# Altium schematic sheet RAM.SchDoc
size B; Organization: Pyrotechnics Management Inc.; DocumentNumber: 10; SheetNumber: 10; SheetTotal: 14; PageSetup: Record=PageOptions|CenterHorizontal=True|CenterVertical=True|PrintScale=0.99|XCorrection=1.00|YCorrection=1.00|PrintKind=1|BorderSize=5000000|LeftOffset=0|BottomOffset=0|Orientation=2|PaperLength=1000|PaperWidth=1000|Scale=100|PaperSource=7|PrintQuality=-4|MediaType=1|DitherType=10|PaperKind=Tabloid (11 x 17")|PrintScaleMode=1; SCHEMATIC_SHEET_TITLE: RAM; PAGE_TITLE: -
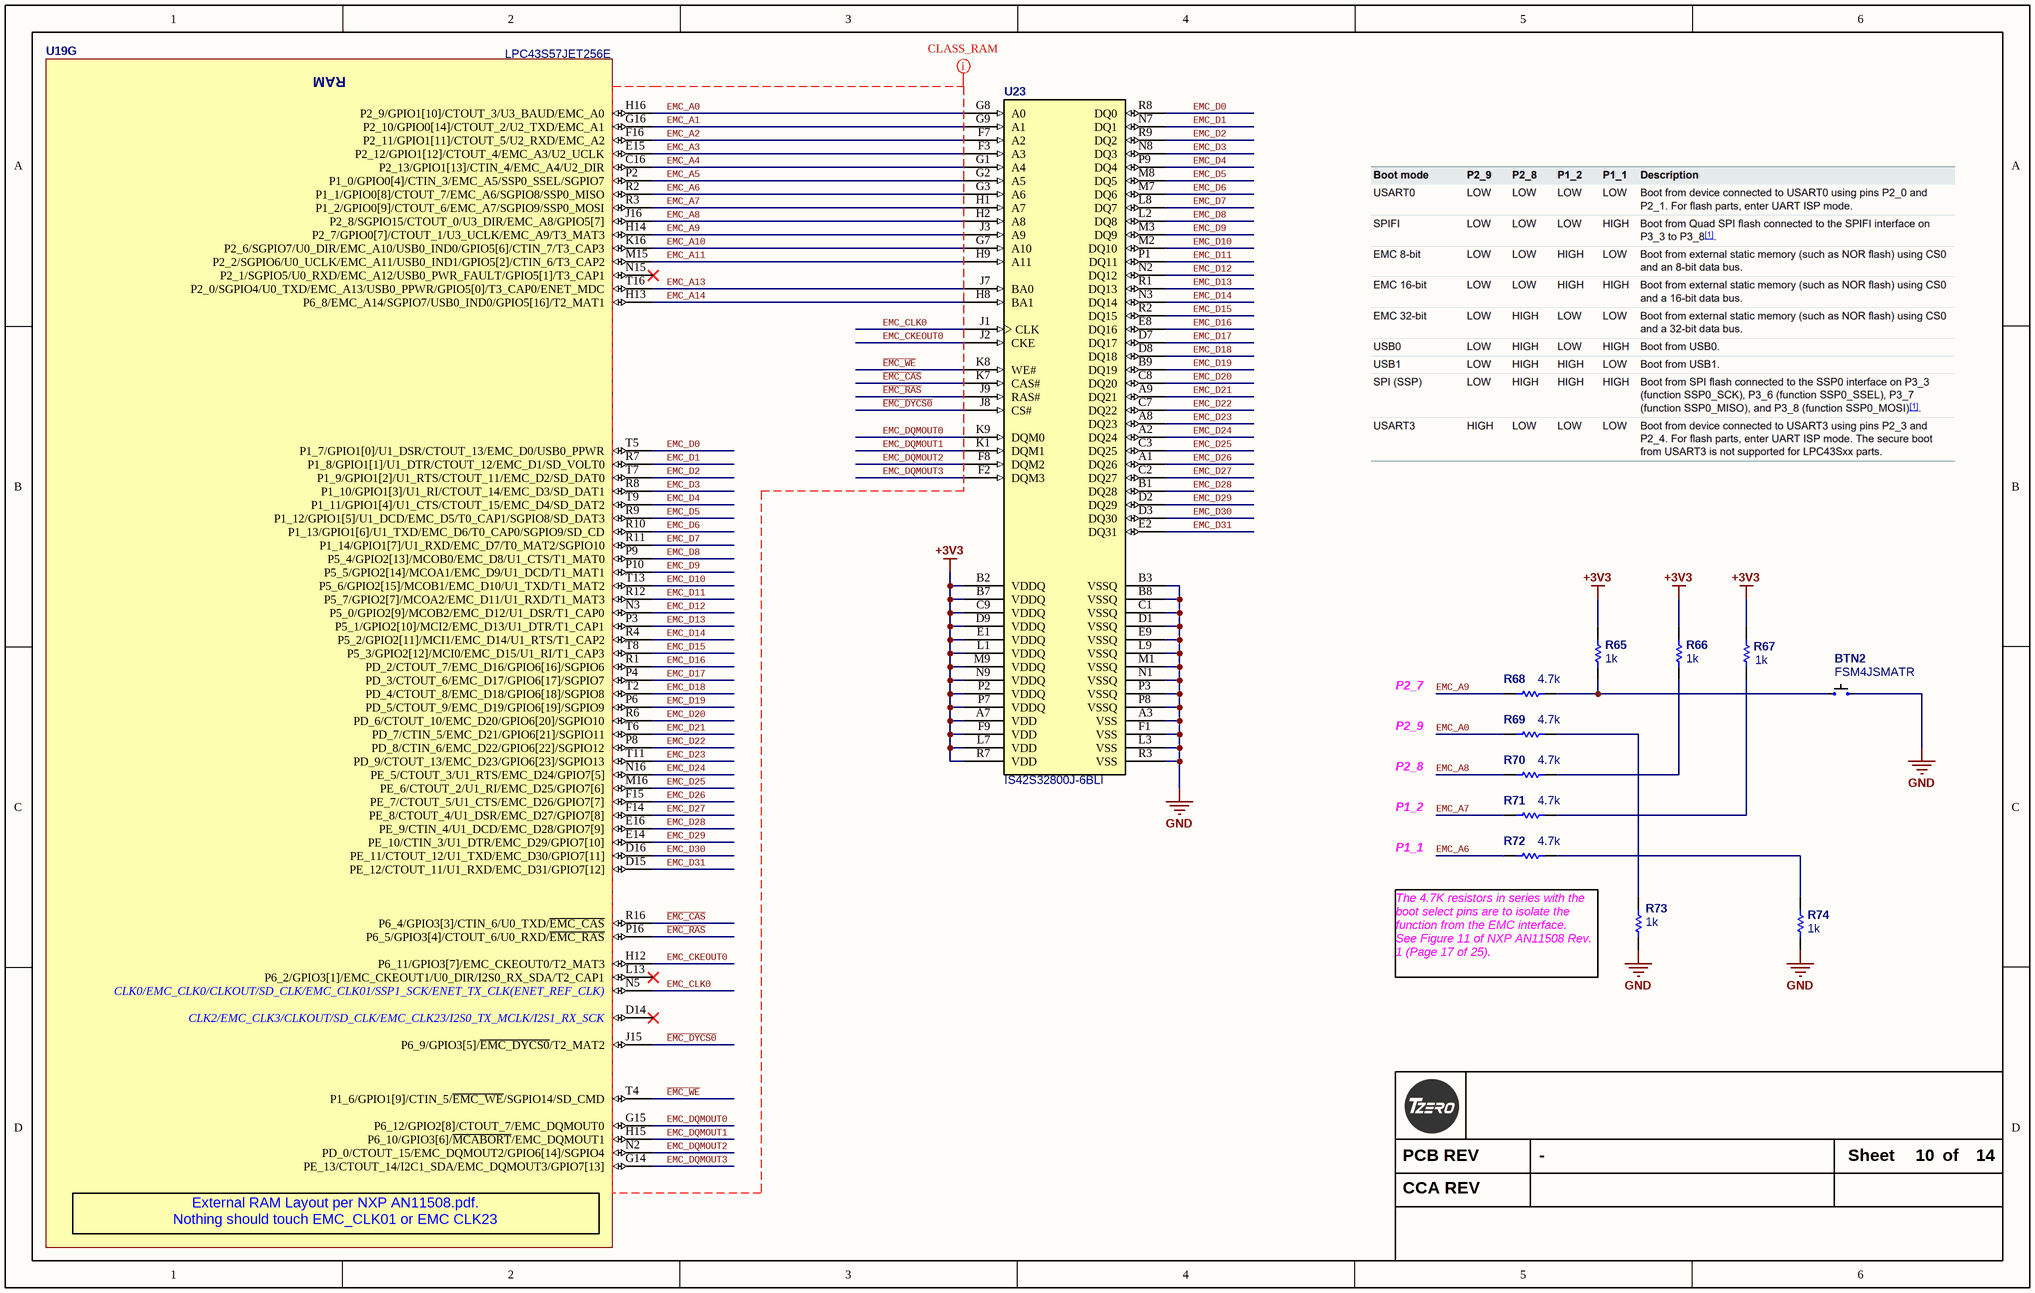
[diagram p0: RAM.SchDoc]

## Parts
BTN2  FSM4JSMATR  [FSM4JSMA]
R65  1k  [R0603_0.55MM_MD]
R66  1k  [R0603_0.55MM_MD]
R67  1k  [R0603_0.55MM_MD]
R68  4.7k  [R0603_0.55MM_MD]
R69  4.7k  [R0603_0.55MM_MD]
R70  4.7k  [R0603_0.55MM_MD]
R71  4.7k  [R0603_0.55MM_MD]
R72  4.7k  [R0603_0.55MM_MD]
R73  1k  [R0603_0.55MM_MD]
R74  1k  [R0603_0.55MM_MD]
U19  LPC43S57JET256E  [LBGA256 16X16 1700X1700X155]  (part G of 10)
U23  IS42S32800J-6BLI  [TFBGA90_8x13]

## Nets
+3V3: R65.2 R66.2 R67.2 U23.A7(VDD) U23.B2(VDDQ) U23.B7(VDDQ) U23.C9(VDDQ) U23.D9(VDDQ) U23.E1(VDDQ) U23.F9(VDD) U23.L1(VDDQ) U23.L7(VDD) U23.M9(VDDQ) U23.N9(VDDQ) U23.P2(VDDQ) U23.P7(VDDQ) U23.R7(VDD)
GND: BTN2.B R73.1 R74.1 U23.A3(VSS) U23.B3(VSSQ) U23.B8(VSSQ) U23.C1(VSSQ) U23.D1(VSSQ) U23.E9(VSSQ) U23.F1(VSS) U23.L3(VSS) U23.L9(VSSQ) U23.M1(VSSQ) U23.N1(VSSQ) U23.P3(VSSQ) U23.P8(VSSQ) U23.R3(VSS)
~{EMC_CAS}: U19.R16(P6_4/GPIO3[3]/CTIN_6/U0_TXD/~{EMC_CAS}) U23.K7(CAS#)
~{EMC_DYCS0}: U19.J15(P6_9/GPIO3[5]/~{EMC_DYCS0}/T2_MAT2) U23.J8(CS#)
~{EMC_RAS}: U19.P16(P6_5/GPIO3[4]/CTOUT_6/U0_RXD/~{EMC_RAS}) U23.J9(RAS#)
~{EMC_WE}: U19.T4(P1_6/GPIO1[9]/CTIN_5/~{EMC_WE}/SGPIO14/SD_CMD) U23.K8(WE#)
EMC_A0: R69.2 U19.H16(P2_9/GPIO1[10]/CTOUT_3/U3_BAUD/EMC_A0) U23.G8(A0)
EMC_A1: U19.G16(P2_10/GPIO0[14]/CTOUT_2/U2_TXD/EMC_A1) U23.G9(A1)
EMC_A2: U19.F16(P2_11/GPIO1[11]/CTOUT_5/U2_RXD/EMC_A2) U23.F7(A2)
EMC_A3: U19.E15(P2_12/GPIO1[12]/CTOUT_4/EMC_A3/U2_UCLK) U23.F3(A3)
EMC_A4: U19.C16(P2_13/GPIO1[13]/CTIN_4/EMC_A4/U2_DIR) U23.G1(A4)
EMC_A5: U19.P2(P1_0/GPIO0[4]/CTIN_3/EMC_A5/SSP0_SSEL/SGPIO7) U23.G2(A5)
EMC_A6: R72.2 U19.R2(P1_1/GPIO0[8]/CTOUT_7/EMC_A6/SGPIO8/SSP0_MISO) U23.G3(A6)
EMC_A7: R71.2 U19.R3(P1_2/GPIO0[9]/CTOUT_6/EMC_A7/SGPIO9/SSP0_MOSI) U23.H1(A7)
EMC_A8: R70.2 U19.J16(P2_8/SGPIO15/CTOUT_0/U3_DIR/EMC_A8/GPIO5[7]) U23.H2(A8)
EMC_A9: R68.2 U19.H14(P2_7/GPIO0[7]/CTOUT_1/U3_UCLK/EMC_A9/T3_MAT3) U23.J3(A9)
EMC_A10: U19.K16(P2_6/SGPIO7/U0_DIR/EMC_A10/USB0_IND0/GPIO5[6]/CTIN_7/T3_CAP3) U23.G7(A10)
EMC_A11: U19.M15(P2_2/SGPIO6/U0_UCLK/EMC_A11/USB0_IND1/GPIO5[2]/CTIN_6/T3_CAP2) U23.H9(A11)
EMC_A13: U19.T16(P2_0/SGPIO4/U0_TXD/EMC_A13/USB0_PPWR/GPIO5[0]/T3_CAP0/ENET_MDC) U23.J7(BA0)
EMC_A14: U19.H13(P6_8/EMC_A14/SGPIO7/USB0_IND0/GPIO5[16]/T2_MAT1) U23.H8(BA1)
EMC_CKEOUT0: U19.H12(P6_11/GPIO3[7]/EMC_CKEOUT0/T2_MAT3) U23.J2(CKE)
EMC_CLK0: U19.N5(CLK0/EMC_CLK0/CLKOUT/SD_CLK/EMC_CLK01/SSP1_SCK/ENET_TX_CLK(ENET_REF_CLK)) U23.J1(CLK)
EMC_D0: U19.T5(P1_7/GPIO1[0]/U1_DSR/CTOUT_13/EMC_D0/USB0_PPWR) U23.R8(DQ0)
EMC_D1: U19.R7(P1_8/GPIO1[1]/U1_DTR/CTOUT_12/EMC_D1/SD_VOLT0) U23.N7(DQ1)
EMC_D2: U19.T7(P1_9/GPIO1[2]/U1_RTS/CTOUT_11/EMC_D2/SD_DAT0) U23.R9(DQ2)
EMC_D3: U19.R8(P1_10/GPIO1[3]/U1_RI/CTOUT_14/EMC_D3/SD_DAT1) U23.N8(DQ3)
EMC_D4: U19.T9(P1_11/GPIO1[4]/U1_CTS/CTOUT_15/EMC_D4/SD_DAT2) U23.P9(DQ4)
EMC_D5: U19.R9(P1_12/GPIO1[5]/U1_DCD/EMC_D5/T0_CAP1/SGPIO8/SD_DAT3) U23.M8(DQ5)
EMC_D6: U19.R10(P1_13/GPIO1[6]/U1_TXD/EMC_D6/T0_CAP0/SGPIO9/SD_CD) U23.M7(DQ6)
EMC_D7: U19.R11(P1_14/GPIO1[7]/U1_RXD/EMC_D7/T0_MAT2/SGPIO10) U23.L8(DQ7)
EMC_D8: U19.P9(P5_4/GPIO2[13]/MCOB0/EMC_D8/U1_CTS/T1_MAT0) U23.L2(DQ8)
EMC_D9: U19.P10(P5_5/GPIO2[14]/MCOA1/EMC_D9/U1_DCD/T1_MAT1) U23.M3(DQ9)
EMC_D10: U19.T13(P5_6/GPIO2[15]/MCOB1/EMC_D10/U1_TXD/T1_MAT2) U23.M2(DQ10)
EMC_D11: U19.R12(P5_7/GPIO2[7]/MCOA2/EMC_D11/U1_RXD/T1_MAT3) U23.P1(DQ11)
EMC_D12: U19.N3(P5_0/GPIO2[9]/MCOB2/EMC_D12/U1_DSR/T1_CAP0) U23.N2(DQ12)
EMC_D13: U19.P3(P5_1/GPIO2[10]/MCI2/EMC_D13/U1_DTR/T1_CAP1) U23.R1(DQ13)
EMC_D14: U19.R4(P5_2/GPIO2[11]/MCI1/EMC_D14/U1_RTS/T1_CAP2) U23.N3(DQ14)
EMC_D15: U19.T8(P5_3/GPIO2[12]/MCI0/EMC_D15/U1_RI/T1_CAP3) U23.R2(DQ15)
EMC_D16: U19.R1(PD_2/CTOUT_7/EMC_D16/GPIO6[16]/SGPIO6) U23.E8(DQ16)
EMC_D17: U19.P4(PD_3/CTOUT_6/EMC_D17/GPIO6[17]/SGPIO7) U23.D7(DQ17)
EMC_D18: U19.T2(PD_4/CTOUT_8/EMC_D18/GPIO6[18]/SGPIO8) U23.D8(DQ18)
EMC_D19: U19.P6(PD_5/CTOUT_9/EMC_D19/GPIO6[19]/SGPIO9) U23.B9(DQ19)
EMC_D20: U19.R6(PD_6/CTOUT_10/EMC_D20/GPIO6[20]/SGPIO10) U23.C8(DQ20)
EMC_D21: U19.T6(PD_7/CTIN_5/EMC_D21/GPIO6[21]/SGPIO11) U23.A9(DQ21)
EMC_D22: U19.P8(PD_8/CTIN_6/EMC_D22/GPIO6[22]/SGPIO12) U23.C7(DQ22)
EMC_D23: U19.T11(PD_9/CTOUT_13/EMC_D23/GPIO6[23]/SGPIO13) U23.A8(DQ23)
EMC_D24: U19.N16(PE_5/CTOUT_3/U1_RTS/EMC_D24/GPIO7[5]) U23.A2(DQ24)
EMC_D25: U19.M16(PE_6/CTOUT_2/U1_RI/EMC_D25/GPIO7[6]) U23.C3(DQ25)
EMC_D26: U19.F15(PE_7/CTOUT_5/U1_CTS/EMC_D26/GPIO7[7]) U23.A1(DQ26)
EMC_D27: U19.F14(PE_8/CTOUT_4/U1_DSR/EMC_D27/GPIO7[8]) U23.C2(DQ27)
EMC_D28: U19.E16(PE_9/CTIN_4/U1_DCD/EMC_D28/GPIO7[9]) U23.B1(DQ28)
EMC_D29: U19.E14(PE_10/CTIN_3/U1_DTR/EMC_D29/GPIO7[10]) U23.D2(DQ29)
EMC_D30: U19.D16(PE_11/CTOUT_12/U1_TXD/EMC_D30/GPIO7[11]) U23.D3(DQ30)
EMC_D31: U19.D15(PE_12/CTOUT_11/U1_RXD/EMC_D31/GPIO7[12]) U23.E2(DQ31)
EMC_DQMOUT0: U19.G15(P6_12/GPIO2[8]/CTOUT_7/EMC_DQMOUT0) U23.K9(DQM0)
EMC_DQMOUT1: U19.H15(P6_10/GPIO3[6]/~{MCABORT}/EMC_DQMOUT1) U23.K1(DQM1)
EMC_DQMOUT2: U19.N2(PD_0/CTOUT_15/EMC_DQMOUT2/GPIO6[14]/SGPIO4) U23.F8(DQM2)
EMC_DQMOUT3: U19.G14(PE_13/CTOUT_14/I2C1_SDA/EMC_DQMOUT3/GPIO7[13]) U23.F2(DQM3)
NetBTN2_A: BTN2.A R65.1 R68.1
NetR66_1: R66.1 R70.1
NetR67_1: R67.1 R71.1
NetR69_1: R69.1 R73.2
NetR72_1: R72.1 R74.2

Not connected (* = marked no-connect by the designer): U19 D14(CLK2/EMC_CLK3/CLKOUT/SD_CLK/EMC_CLK23/I2S0_TX_MCLK/I2S1_RX_SCK)* L13(P6_2/GPIO3[1]/EMC_CKEOUT1/U0_DIR/I2S0_RX_SDA/T2_CAP1)* N15(P2_1/SGPIO5/U0_RXD/EMC_A12/USB0_PWR_FAULT/GPIO5[1]/T3_CAP1)*

## Layout directives
net class CLASS_RAM: EMC_A0, EMC_A1, EMC_A2, EMC_A3, EMC_A4, EMC_A5, EMC_A6, EMC_A7, EMC_A8, EMC_A9, EMC_A10, EMC_A11, EMC_A13, EMC_A14, EMC_CKEOUT0, EMC_CLK0, EMC_D0, EMC_D1, EMC_D2, EMC_D3, EMC_D4, EMC_D5, EMC_D6, EMC_D7, EMC_D8, EMC_D9, EMC_D10, EMC_D11, EMC_D12, EMC_D13, EMC_D14, EMC_D15, EMC_D16, EMC_D17, EMC_D18, EMC_D19, EMC_D20, EMC_D21, EMC_D22, EMC_D23, EMC_D24, EMC_D25, EMC_D26, EMC_D27, EMC_D28, EMC_D29, EMC_D30, EMC_D31, EMC_DQMOUT0, EMC_DQMOUT1, EMC_DQMOUT2, EMC_DQMOUT3, ~{EMC_CAS}, ~{EMC_DYCS0}, ~{EMC_RAS}, ~{EMC_WE}

## Notes on the sheet
- P2_7
- P2_9
- P2_8
- P1_2
- P1_1
- The 4.7K resistors in series with the boot select pins are to isolate the function from the EMC interface.   See Figure 11 of NXP AN11508 Rev. 1 (Page 17 of 25).
- PCB REV
- Sheet
- of
- CCA REV
- (in symbol LPC43S57JET256E, part G) RAM; External RAM Layout per NXP AN11508.pdf. / Nothing should touch EMC_CLK01 or EMC CLK23

## Library data of the parts
BTN2 = FSM4JSMATR: SWITCH TACTILE SPST-NO 0.05A 12V; Manufacturer: TE Connectivity; Switch Function: Off-Mom; Contact Rating @ Voltage: 0.05A @ 12VDC; Actuator Type: Standard; Actuator Orientation: Top Actuated; Outline: 6.00mm x 6.00mm; Illumination: Non-Illuminated; Operating Force: 160gf; Supplier 1: Digi-Key; Supplier Part Number 1: 450-1759-1-ND; Manufacturer Part Number: FSM4JSMATR; RoHS: RoHS Compliant; Category: Switches; Stock 1: 35617; Pricing 1: 1=0.36, 10=0.34, 25=0.2912, 50=0.2474, 100=0.2377, 250=0.21344, 500=0.20374 (USD); Circuit: SPST-NO; Mounting Type: Surface Mount; Termination Style: Gull Wing; Packaging: Cut Tape (CT); ComponentLink1URL: http://documents.tycoelectronics.com/commerce/DocumentDelivery/DDEController?Action=srchrtrv&DocNm=2-1437565-7&DocType=CD&DocLang=EN; ComponentLink1Description: http://documents.tycoelectronics.com/commerce/DocumentDelivery/DDEController?Action=srchrtrv&DocNm=2-1437565-7&DocType=CD&DocLang=EN; Value: FSM4JSMATR
R65-R67 R73 R74 = ERJ-3EKF1001V: RES 1K OHM 1/10W 1% 0603 SMD; Manufacturer: Panasonic Electronic Components; Power (Watts): 0.1W- 1/10W; Temperature Coefficient: ±100ppm/°C; Package Power: 0603  (0.1W); Limiting Element Voltage: 75; Maximum Overload Voltage: 150; Maximum Working Voltage: 10.0V; Substitution Notes: 1k , ±1% , 0603 , AEC-Q200; Value: 1k; Supplier 1: Digi-Key; Supplier Part Number 1: P1.00KHCT-ND; Manufacturer Part Number: ERJ-3EKF1001V; Category: Resistors; Sort Value: 1000; Composition: Thick Film; Features: -; Tolerance: ±1%; Package: 0603 (1608 Metric); Size / Dimension: 0.063" L x 0.031" W (1.60mm x 0.80mm); Height: 0.55MM; Packaging: Cut Tape (CT); ComponentLink1URL: datasheets\Panasonic Electronic Components\AOA0000CE2.pdf; ComponentLink1Description: Internal Datasheet; ComponentLink2Description: External Datasheet; ComponentLink2URL: http://industrial.panasonic.com/www-data/pdf/AOA0000/AOA0000CE2.pdf; Resistance (Ohms): 1k; Supplier Package: 0603; Number of Terminations: 2; Sort Value Package: 603_1000; Ratings: AEC-Q200
R68-R72 = ERJ-3EKF4701V: RES 4.7K OHM 1/10W 1% 0603 SMD; Manufacturer: Panasonic Electronic Components; Power (Watts): 0.1W- 1/10W; Temperature Coefficient: ±100ppm/°C; Package Power: 0603  (0.1W); Limiting Element Voltage: 75; Maximum Overload Voltage: 150; Maximum Working Voltage: 21.7V; Substitution Notes: 4.7k , ±1% , 0603 , AEC-Q200; Value: 4.7k; Supplier 1: Digi-Key; Supplier Part Number 1: P4.70KHCT-ND; Manufacturer Part Number: ERJ-3EKF4701V; Category: Resistors; Sort Value: 4700; Composition: Thick Film; Features: -; Tolerance: ±1%; Package: 0603 (1608 Metric); Size / Dimension: 0.063" L x 0.031" W (1.60mm x 0.80mm); Height: 0.55MM; Packaging: Cut Tape (CT); ComponentLink1URL: datasheets\Panasonic Electronic Components\AOA0000CE2.pdf; ComponentLink1Description: Internal Datasheet; ComponentLink2Description: External Datasheet; ComponentLink2URL: http://industrial.panasonic.com/www-data/pdf/AOA0000/AOA0000CE2.pdf; Resistance (Ohms): 4.7k; Supplier Package: 0603; Number of Terminations: 2; Sort Value Package: 603_4700; Ratings: AEC-Q200
U19 = LPC43S57JET256E: ARM Microcontrollers - MCU CortexM0/4 32bit 1MB Cortex-M4/M0; Manufacturer: NXP Semiconductors; CategorySort: 600; Data RAM Size: 136 KB; Core: ARM Cortex M4/M0; Maximum Clock Frequency: 204 MHz; On-Chip ADC: Yes; Operating Supply Voltage: 2.2 V to 3.6 V; Processor Series: LPC4357; Product Status: New Technology; Value: LPC43S57JET256E; Sort Value: *; Category: Integrated Circuits; Supplier 1: Digi-Key; Supplier Part Number 1: 568-11712-ND; Manufacturer Part Number: LPC43S57JET256E; RoHS: RoHS Compliant; Stock 1: 108; Pricing 1: 1=14.40, 25=13.31, 100=12.24, 250=11.16, 500=10.43, 1000=9.57 (USD); Package: LBGA-256; Packaging: Tray; Mounting Style: SMD/SMT; Program Memory Size: 1 MB; Data Bus Width: 32 bit; Maximum Operating Temperature: + 85 C; Minimum Operating Temperature: - 40 C; Standard Pack Qty: 90; Tradename: LPC; RoHS - Mouser: Y; Minimum Order Quantity: 1; Reeling: False; ComponentLink1URL: http://www.nxp.com/documents/data_sheet/LPC4357_53_37_33.pdf; ComponentLink1Description: http://www.nxp.com/documents/data_sheet/LPC4357_53_37_33.pdf
U23 = IS42S32800J-6BLI: IC DRAM 256M PARALLEL 90TFBGA; Manufacturer: ISSI; CategorySort: 600; Packaging 1: Tray; Memory Type: RAM,SDRAM; Frequency: 166MHz; Category: Integrated Circuits; Value: IS42S32800J-6BLI; Supplier 1: Digi-Key; Supplier Part Number 1: 706-1451-ND; Manufacturer Part Number: IS42S32800J-6BLI; Stock 1: 49; Pricing 1: 1=8.98000, 10=8.26100, 25=8.08960, 50=8.06100, 100=7.23150, 250=7.01224, 500=6.66904, 1000=6.43545 (USD); RoHS: Yes; Case/Package: TFBGA; Min Operating Temperature: -40°C; Max Operating Temperature: 85°C; Interface: Parallel; ComponentLink1URL: http://www.mouser.com/ds/2/198/42-45S32800J-706492.pdf?src-supplier=Mouser; ComponentLink1Description: http://www.mouser.com/ds/2/198/42-45S32800J-706492.pdf?src-supplier=Mouser; ComponentLink2URL: http://www.issi.com/WW/pdf/42-45S32800J.pdf?src-supplier=Avnet; ComponentLink2Description: http://www.issi.com/WW/pdf/42-45S32800J.pdf?src-supplier=Avnet; ComponentLink3URL: http://www.issi.com/WW/pdf/42-45S32800J.pdf?src-supplier=Digi-Key; ComponentLink3Description: http://www.issi.com/WW/pdf/42-45S32800J.pdf?src-supplier=Digi-Key